# EasyEDA schematic ATmega_lightSensor_blink.json
TITLE: ATmega328p_OLED; REV: 1.0; Date: 2022-11-03; Sheet: 1/1; Drawn By: carlosvidal; Company: Linköpings Universitet
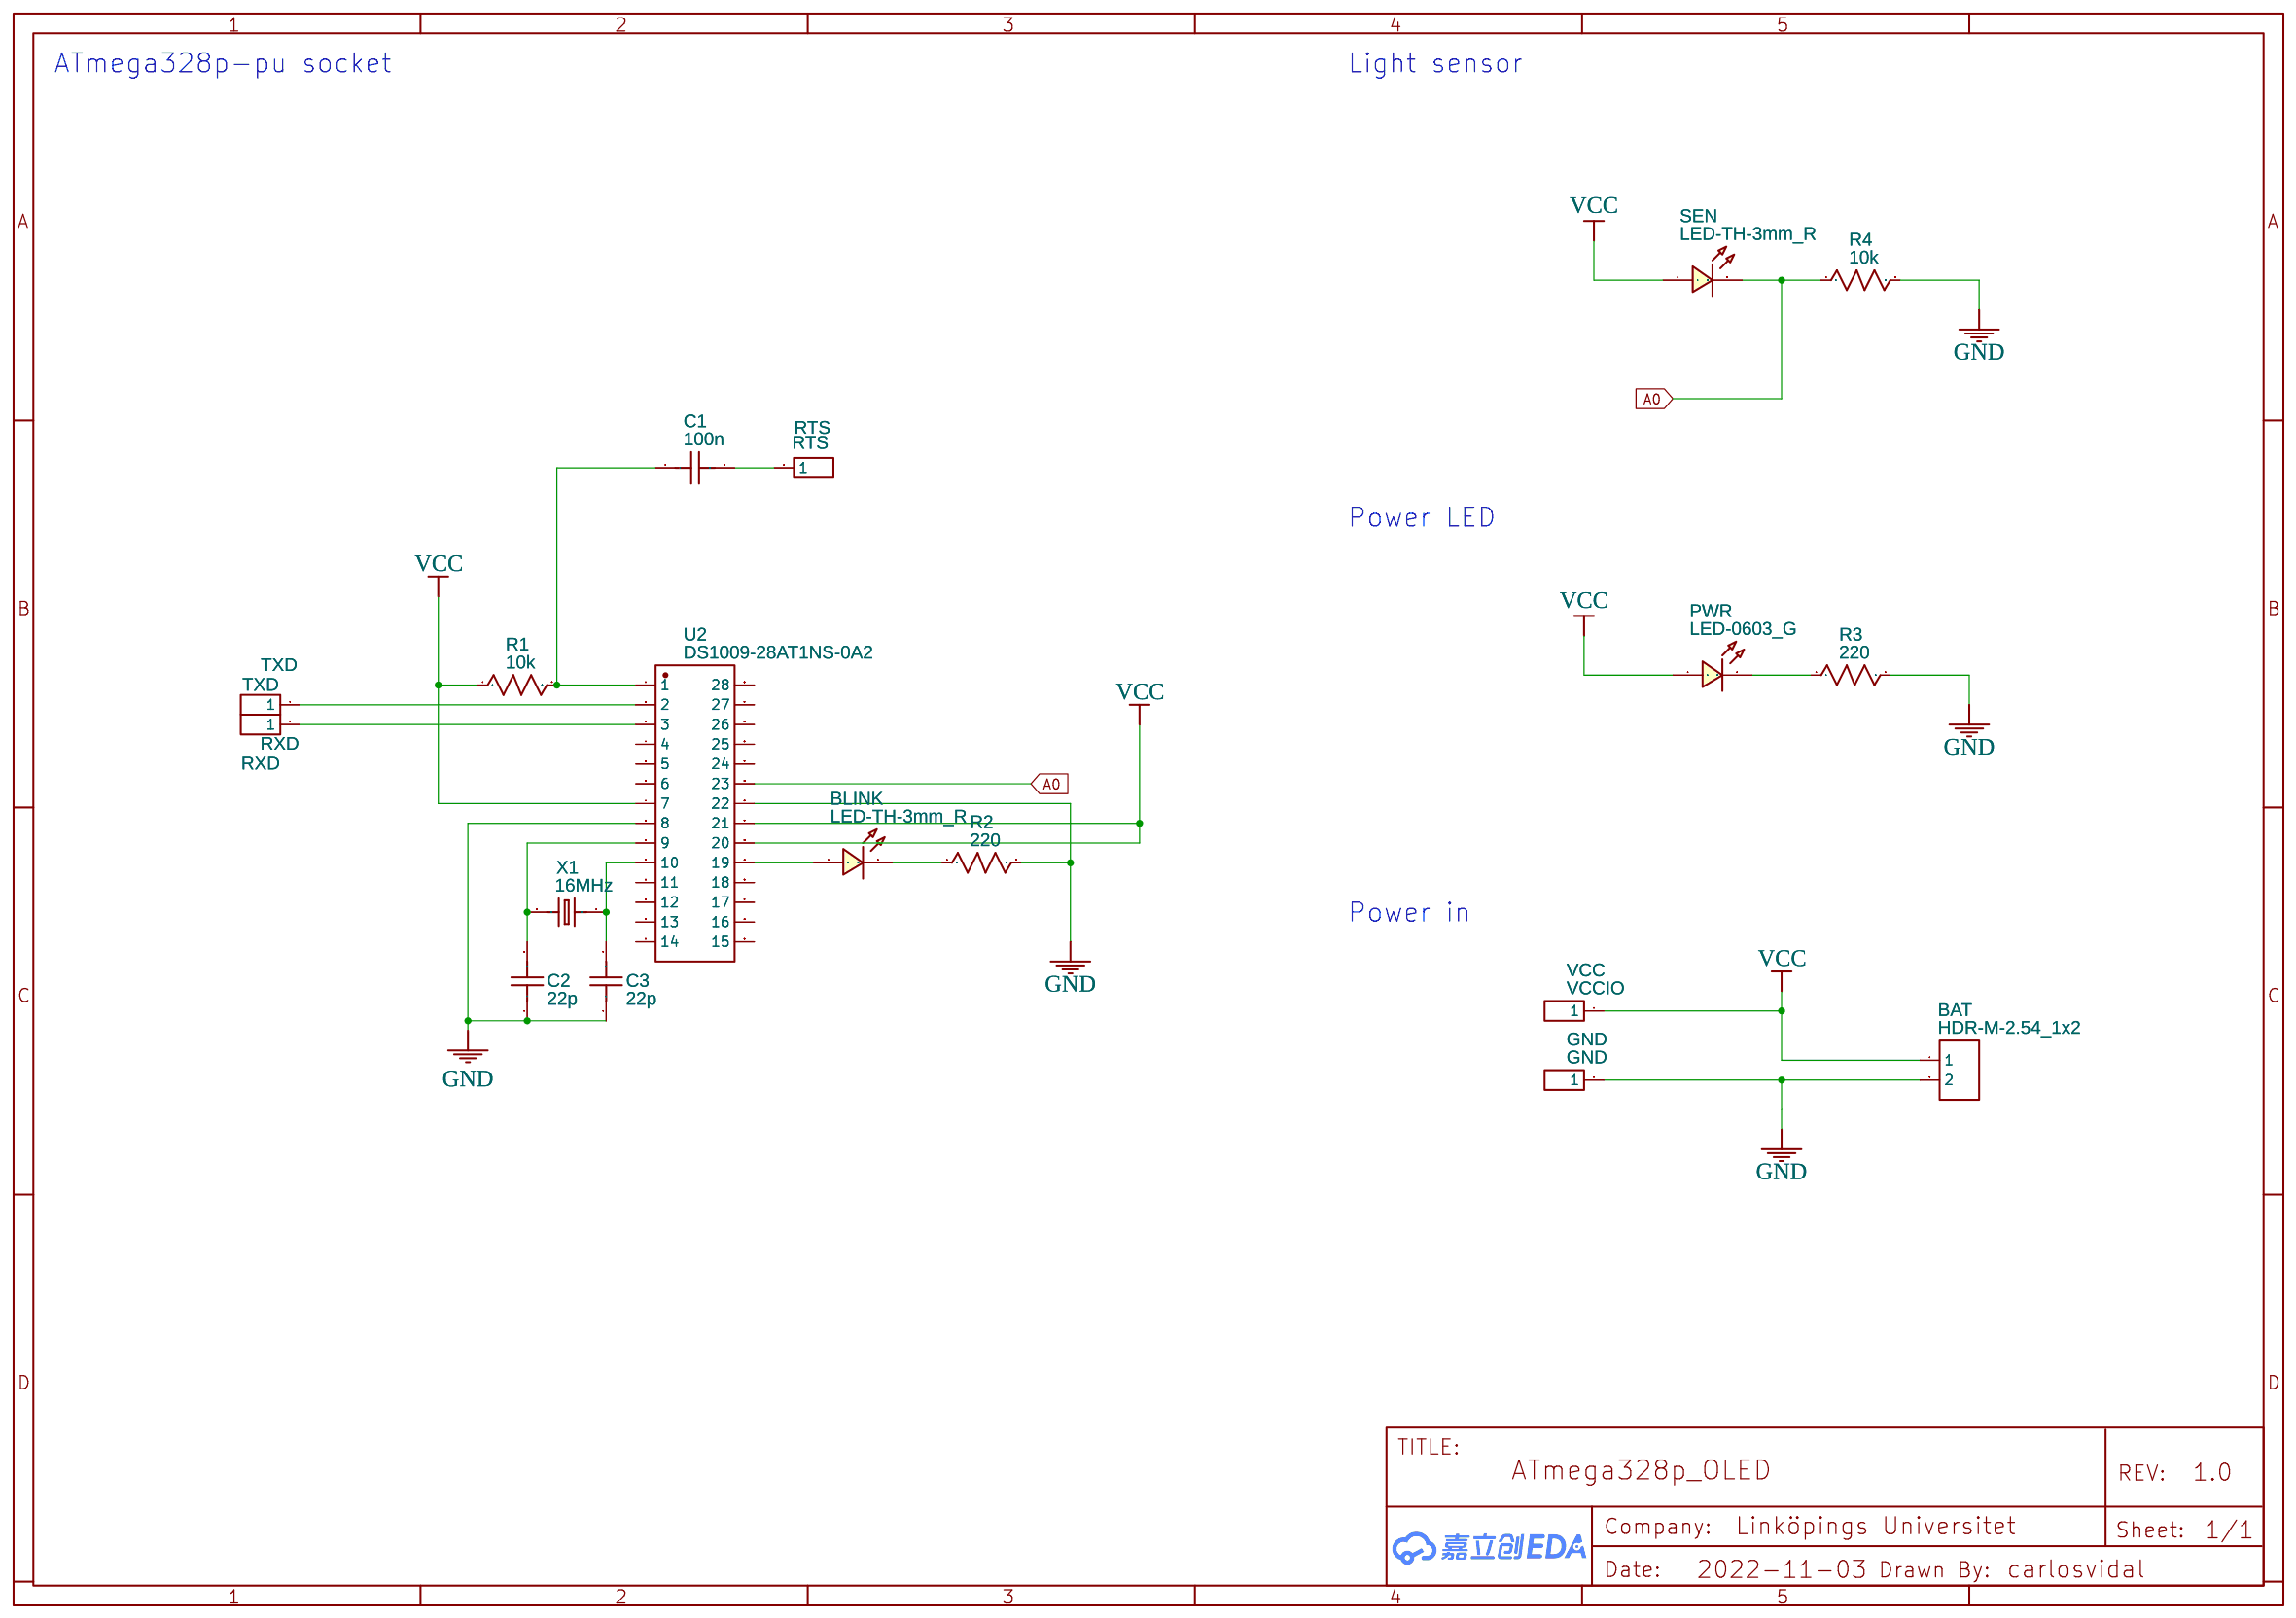
[diagram p0: schematic sheet]

## Parts
BAT  HDR-M-2.54_1x2  [HDR-M-2.54_1X2]
BLINK  LED-TH-3mm_R  [LED-TH_BD3.0_RED]
C1  100n  [C0603]
C2  22p  [C0603]
C3  22p  [C0603]
GND  GND  [HDR-M-2.54_1X1]
PWR  LED-0603_G  [LED0603_GREEN]
R1  10k  [R0603]
R2  220  [R0603]
R3  220  [R0603]
R4  10k  [R0603]
RTS  RTS  [HDR-M-2.54_1X1]
RXD  RXD  [HDR-M-2.54_1X1]
SEN  LED-TH-3mm_R  [LED-TH_BD3.0_RED]
TXD  TXD  [HDR-M-2.54_1X1]
U2  DS1009-28AT1NS-0A2  [DIP-28_L35.6-W10.2-P2.54-LS7.6-BL-2]
VCC  VCCIO  [HDR-M-2.54_1X1]
X1  16MHz  [HC-49S_L11.4-W4.8]

## Library data of the parts
BAT = HDR-M-2.54_1x2: Supplier Part: C124375; Supplier: LCSC; Contributor: LCEDA_Lib
BLINK SEN = LED-TH-3mm_R: Manufacturer: EVERLIGHT(台湾亿光); Manufacturer Part: 204-10SDRD/S530-A3-L; Supplier Part: C84774; Supplier: LCSC; Contributor: LCEDA_Lib
C1-C3 = C_0603_US: Contributor: LCEDA_Lib
GND RTS RXD TXD VCC = HDR-M-2.54_1x1: Supplier Part: C81276; Supplier: LCSC; Contributor: LCEDA_Lib
PWR = LED-0603_G: Manufacturer: EVERLIGHT(台湾亿光); Manufacturer Part: 19-217/GHC-YR1S2/3T; Supplier Part: C72043; Supplier: LCSC; Contributor: LCEDA_Lib
R1-R4 = R_0603_US: Contributor: LCEDA_Lib
U2 = DS1009-28AT1NS-0A2: Supplier: LCSC; Manufacturer: CONNFLY; Contributor: LCSC; Supplier Part: C72125; JLCPCB Part Class: Extended Part
X1 = HC-49SM16MHz20pF30ppm: Supplier: LCSC; Manufacturer: TAE(雅晶鑫); Manufacturer Part: TAXM16M2GLFBET2T; Supplier Part: C111377; JLCPCB Part Class: Extended Part

## Nets
GND: BAT.2 C2.1 C3.1 GND.1 R2.2 R3.2 R4.2 U2.8 U2.22
VCC: BAT.1 PWR.1 R1.1 SEN.1 U2.7 U2.20 U2.21 VCC.1
A0: R4.1 SEN.2 U2.23
Net-(BLINK-1): BLINK.1 U2.19
Net-(BLINK-2): BLINK.2 R2.1
Net-(C1-1): C1.1 R1.2 U2.1
Net-(C1-2): C1.2 RTS.1
Net-(C2-2): C2.2 U2.9 X1.2
Net-(C3-2): C3.2 U2.10 X1.1
Net-(PWR-2): PWR.2 R3.1
Net-(RXD-1): RXD.1 U2.3
Net-(TXD-1): TXD.1 U2.2

Not connected (* = marked no-connect by the designer): U2 4 5 6 11 12 13 14 15 16 17 18 24 25 26 27 28

## Notes on the sheet
- ATmega328p-pu socket
- Light sensor
- Power LED
- Power in
